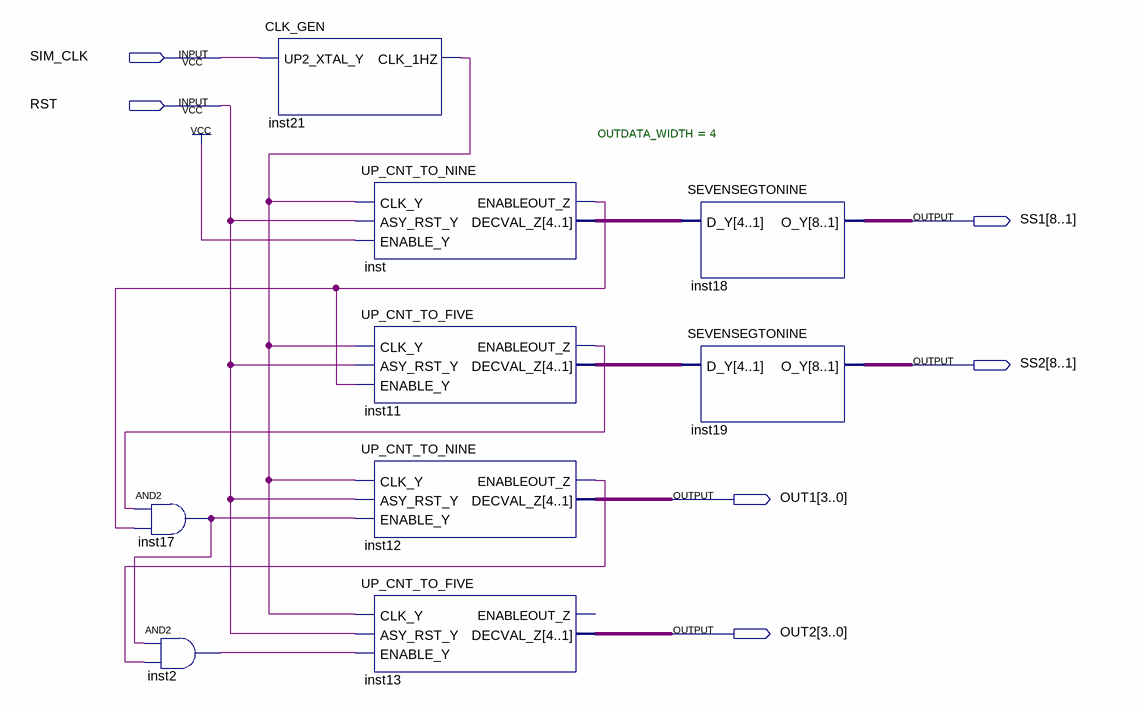
[diagram p0: schematic sheet]
// Quartus schematic Project4_FLEX.bdf as structural Verilog: 9 symbols, 6 pins
module Project4_FLEX (
  input  SIM_CLK,
  input  RST,
  output [8:1] SS1,
  output [8:1] SS2,
  output [3:0] OUT1,
  output [3:0] OUT2
);

  wire inst2_out, inst11_enableout_z, inst12_enableout_z, inst17_out, inst21_clk_1hz, inst_enableout_z;
  wire [3:0] inst11_decval_z, inst_decval_z;

  and inst17 (inst17_out, inst11_enableout_z, inst_enableout_z);
  and inst2 (inst2_out, inst17_out, inst12_enableout_z);
  CLK_GEN inst21 (.UP2_XTAL_Y(SIM_CLK), .CLK_1HZ(inst21_clk_1hz));
  UP_CNT_TO_NINE #(.OUTDATA_WIDTH(4)) inst (
    .CLK_Y(inst21_clk_1hz), .ASY_RST_Y(RST), .ENABLE_Y(1'b1), .ENABLEOUT_Z(inst_enableout_z),
    .DECVAL_Z(inst_decval_z));
  UP_CNT_TO_FIVE inst11 (
    .CLK_Y(inst21_clk_1hz), .ASY_RST_Y(RST), .ENABLE_Y(inst_enableout_z), .ENABLEOUT_Z(inst11_enableout_z),
    .DECVAL_Z(inst11_decval_z));
  UP_CNT_TO_NINE inst12 (
    .CLK_Y(inst21_clk_1hz), .ASY_RST_Y(RST), .ENABLE_Y(inst17_out), .ENABLEOUT_Z(inst12_enableout_z),
    .DECVAL_Z(OUT1));
  UP_CNT_TO_FIVE inst13 (
    .CLK_Y(inst21_clk_1hz), .ASY_RST_Y(RST), .ENABLE_Y(inst2_out), .DECVAL_Z(OUT2));  // open: ENABLEOUT_Z
  SEVENSEGTONINE inst18 (.D_Y(inst_decval_z), .O_Y(SS1));
  SEVENSEGTONINE inst19 (.D_Y(inst11_decval_z), .O_Y(SS2));
endmodule
